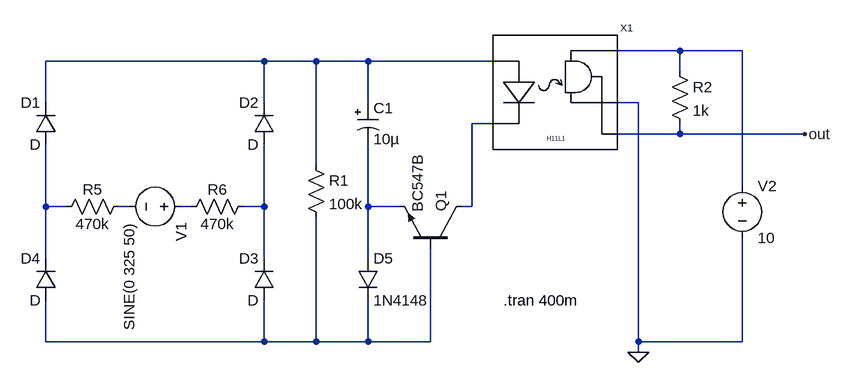
[diagram p0: schematic H11L1-jig.asc]
H11L1-jig.asc, the LTspice schematic file:
Version 4
SHEET 1 880 680
WIRE 288 -160 192 -160
WIRE 384 -160 288 -160
WIRE -352 -144 -688 -144
WIRE -272 -144 -352 -144
WIRE -192 -144 -272 -144
WIRE 0 -144 -192 -144
WIRE 288 -128 288 -160
WIRE -688 -80 -688 -144
WIRE -352 -80 -352 -144
WIRE -192 -80 -192 -144
WIRE 224 -80 192 -80
WIRE 0 -48 -32 -48
WIRE 288 -32 288 -48
WIRE 288 -32 192 -32
WIRE 480 -32 288 -32
WIRE -272 16 -272 -144
WIRE 384 48 384 -160
WIRE -688 80 -688 -16
WIRE -656 80 -688 80
WIRE -560 80 -576 80
WIRE -464 80 -480 80
WIRE -352 80 -352 -16
WIRE -352 80 -384 80
WIRE -192 80 -192 -16
WIRE -144 80 -192 80
WIRE -32 80 -32 -48
WIRE -32 80 -48 80
WIRE -688 160 -688 80
WIRE -352 160 -352 80
WIRE -192 160 -192 80
WIRE -688 288 -688 224
WIRE -352 288 -352 224
WIRE -352 288 -688 288
WIRE -272 288 -272 96
WIRE -272 288 -352 288
WIRE -192 288 -192 224
WIRE -192 288 -272 288
WIRE -96 288 -96 144
WIRE -96 288 -192 288
WIRE 224 288 224 -80
WIRE 384 288 384 128
WIRE 384 288 224 288
WIRE 224 304 224 288
FLAG 224 304 0
FLAG 480 -32 out
SYMBOL _PERSONAL\\opto\\H11L1 96 -80 R0
SYMATTR InstName X1
SYMBOL voltage -464 80 R90
WINDOW 123 0 0 Left 0
WINDOW 39 0 0 Left 0
SYMATTR InstName V1
SYMATTR Value SINE(0 325 50)
SYMBOL voltage 384 32 R0
WINDOW 123 0 0 Left 0
WINDOW 39 0 0 Left 0
SYMATTR InstName V2
SYMATTR Value 10
SYMBOL res 272 -144 R0
SYMATTR InstName R2
SYMATTR Value 1k
SYMBOL diode -672 -16 R180
WINDOW 0 24 64 Left 2
WINDOW 3 24 0 Left 2
SYMATTR InstName D1
SYMBOL diode -336 -16 R180
WINDOW 0 24 64 Left 2
WINDOW 3 24 0 Left 2
SYMATTR InstName D2
SYMBOL diode -336 224 R180
WINDOW 0 24 64 Left 2
WINDOW 3 24 0 Left 2
SYMATTR InstName D3
SYMBOL diode -672 224 R180
WINDOW 0 24 64 Left 2
WINDOW 3 24 0 Left 2
SYMATTR InstName D4
SYMBOL res -560 64 R90
WINDOW 0 5 56 VBottom 2
WINDOW 3 27 56 VTop 2
SYMATTR InstName R5
SYMATTR Value 470k
SYMBOL res -368 64 R90
WINDOW 0 5 56 VBottom 2
WINDOW 3 27 56 VTop 2
SYMATTR InstName R6
SYMATTR Value 470k
SYMBOL polcap -208 -80 R0
WINDOW 3 24 56 Left 2
SYMATTR InstName C1
SYMATTR Value 10µ
SYMATTR Description Capacitor
SYMATTR Type cap
SYMATTR SpiceLine V=16 Irms=17m Rser=2.2912 Lser=1.06n mfg="Würth Elektronik" pn="865230340001 WCAP-AS5H 4x5,5" type="Al electrolytic"
SYMBOL diode -208 160 R0
SYMATTR InstName D5
SYMATTR Value 1N4148
SYMBOL npn -48 144 M270
SYMATTR InstName Q1
SYMATTR Value BC547B
SYMBOL res -288 0 R0
SYMATTR InstName R1
SYMATTR Value 100k
TEXT 16 224 Left 2 !.tran 400m

The netlist it stands for:
* H11L1-jig.asc
XX1 N002 N003 N001 0 out H11L1 ion=1.33m ioff=1m KT=1  ; pins Anode Cathode Vcc Gnd Out
V1 N006 N005 SINE(0 325 50)
V2 N001 0 10
R2 N001 out 1k
D1 N004 N002 D
D2 N007 N002 D
D3 N009 N007 D
D4 N009 N004 D
R5 N005 N004 470k
R6 N007 N006 470k
C1 N002 N008 10µ V=16 Irms=17m Rser=2.2912 Lser=1.06n mfg="Würth Elektronik" pn="865230340001 WCAP-AS5H 4x5,5" type="Al electrolytic"
D5 N008 N009 1N4148
Q1 N003 N009 N008 0 BC547B
R1 N002 N009 100k
.model D D
.lib standard.dio
.model NPN NPN
.model PNP PNP
.lib standard.bjt
.tran 400m
.lib ../sym/_PERSONAL/opto/H11L1.sub
.backanno
.end